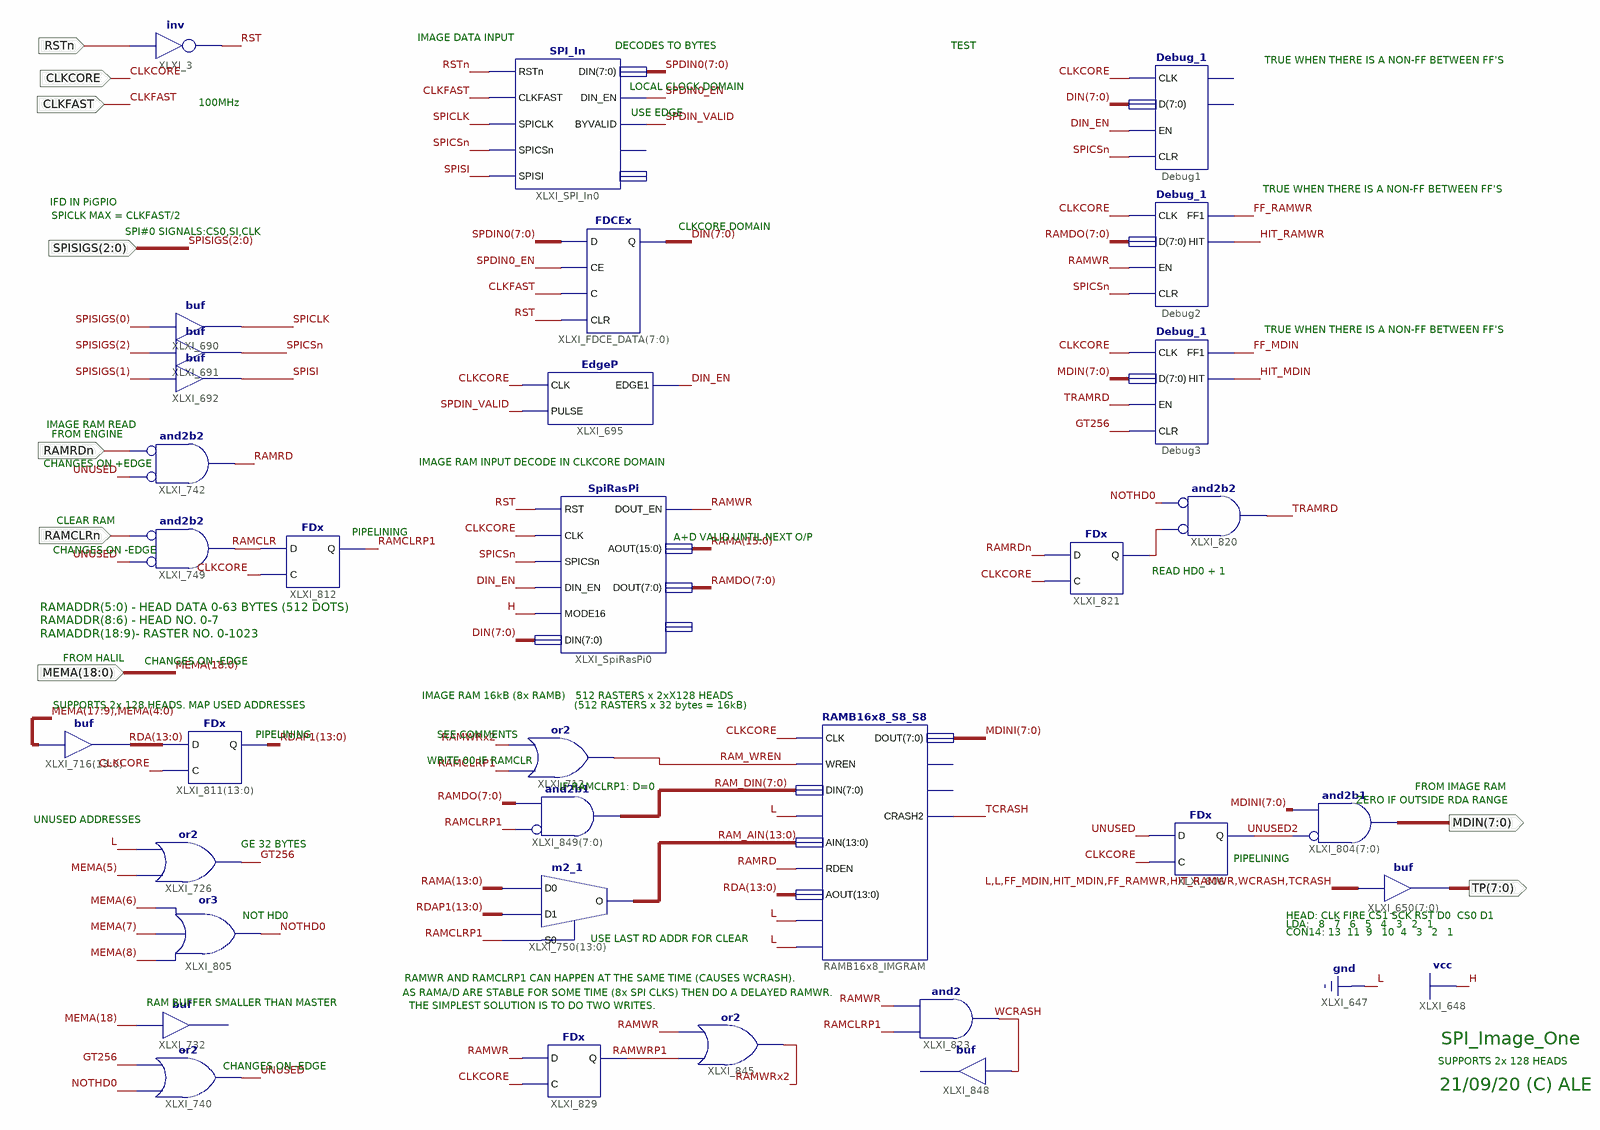
[diagram p0: schematic sheet 1]
// Xilinx ISE schematic SPI_Image_One.sch (spartan6) as structural Verilog: 33 symbols, 9 ports
module SPI_Image_One (
  input  CLKCORE,
  input  RSTn,
  input  [2:0] SPISIGS,
  input  CLKFAST,
  input  RAMCLRn,
  input  RAMRDn,
  input  [18:0] MEMA,
  output [7:0] TP,
  output [7:0] MDIN
);

  wire DIN_EN, FF_MDIN, FF_RAMWR, GT256, HIT_MDIN, HIT_RAMWR, NOTHD0, RAM_WREN, RAMCLR, RAMCLRP1, RAMRD,
       RAMWR, RAMWRP1, RAMWRx2, RST, SPDIN0_EN, SPDIN_VALID, SPICLK, SPICSn, SPISI, TCRASH, TRAMRD, UNUSED,
       UNUSED2, WCRASH, XLXN_62;
  wire [7:0] DIN, MDINI, RAM_DIN, RAMDO, SPDIN0;
  wire [13:0] RAM_AIN, RDA, RDAP1;
  wire [15:0] RAMA;

  buf XLXI_691 (SPICSn, SPISIGS[2]);
  buf XLXI_692 (SPISI, SPISIGS[1]);
  buf XLXI_690 (SPICLK, SPISIGS[0]);
  not XLXI_3 (RST, RSTn);
  and XLXI_742 (RAMRD, ~UNUSED, ~RAMRDn);  // and2b2
  or XLXI_726 (GT256, MEMA[5], 1'b0);
  and XLXI_749 (RAMCLR, ~UNUSED, ~RAMCLRn);  // and2b2
  or XLXI_805 (NOTHD0, MEMA[8], MEMA[7], MEMA[6]);
  // buf XLXI_732 has open pins: I=MEMA[18], O=open
  or XLXI_740 (UNUSED, NOTHD0, GT256);
  assign TP = {2'b00, FF_MDIN, HIT_MDIN, FF_RAMWR, HIT_RAMWR, WCRASH, TCRASH};  // buf XLXI_650[7..0], 8 bits wide
  assign MDIN = ~{8{UNUSED2}} & MDINI;  // and2b1 XLXI_804[7..0], 8 bits wide
  FDx XLXI_806 (.C(CLKCORE), .D(UNUSED), .Q(UNUSED2));
  FDx XLXI_812 (.C(CLKCORE), .D(RAMCLR), .Q(RAMCLRP1));
  Debug_1 Debug1 (.CLK(CLKCORE), .CLR(SPICSn), .D(DIN), .EN(DIN_EN));  // open: FF1, HIT
  Debug_1 Debug2 (.CLK(CLKCORE), .CLR(SPICSn), .D(RAMDO), .EN(RAMWR), .FF1(FF_RAMWR), .HIT(HIT_RAMWR));
  Debug_1 Debug3 (.CLK(CLKCORE), .CLR(GT256), .D(MDIN), .EN(TRAMRD), .FF1(FF_MDIN), .HIT(HIT_MDIN));
  FDx XLXI_821 (.C(CLKCORE), .D(RAMRDn), .Q(XLXN_62));
  and XLXI_820 (TRAMRD, ~XLXN_62, ~NOTHD0);  // and2b2
  SPI_In XLXI_SPI_In0 (
    .BYVALID(SPDIN_VALID), .CLKFAST(CLKFAST), .DIN(SPDIN0), .DIN_EN(SPDIN0_EN), .RSTn(RSTn), .SPICLK(SPICLK),
    .SPICSn(SPICSn), .SPISI(SPISI));  // open: CSEDGE, TP
  FDCEx XLXI_FDCE_DATA[7:0] (.C(CLKFAST), .CE(SPDIN0_EN), .CLR(RST), .D(SPDIN0), .Q(DIN));
  EdgeP XLXI_695 (.CLK(CLKCORE), .EDGE1(DIN_EN), .PULSE(SPDIN_VALID));
  SpiRasPi XLXI_SpiRasPi0 (
    .RST(RST), .CLK(CLKCORE), .SPICSn(SPICSn), .DIN_EN(DIN_EN), .MODE16(1'b1), .DIN(DIN), .DOUT_EN(RAMWR),
    .AOUT(RAMA), .DOUT(RAMDO));  // open: TP
  m2_1 XLXI_750[13:0] (.D0(RAMA[13:0]), .D1(RDAP1), .S0(RAMCLRP1), .O(RAM_AIN));
  or XLXI_712 (RAM_WREN, RAMCLRP1, RAMWRx2);
  assign RDA = {MEMA[17:9], MEMA[4:0]};  // buf XLXI_716[13..0], 14 bits wide
  FDx XLXI_811[13:0] (.C(CLKCORE), .D(RDA), .Q(RDAP1));
  FDx XLXI_829 (.C(CLKCORE), .D(RAMWR), .Q(RAMWRP1));
  or XLXI_845 (RAMWRx2, RAMWRP1, RAMWR);
  assign RAM_DIN = ~{8{RAMCLRP1}} & RAMDO;  // and2b1 XLXI_849[7..0], 8 bits wide
  and XLXI_823 (WCRASH, RAMCLRP1, RAMWR);
  // buf XLXI_848 has open pins: I=WCRASH, O=open
  RAMB16x8_S8_S8 RAMB16x8_IMGRAM (
    .AIN(RAM_AIN), .AOUT(RDA), .CLK(CLKCORE), .CRASH2(TCRASH), .DIN(RAM_DIN), .DIN8(1'b0), .DOUT(MDINI),
    .LIMIT2(1'b0), .LIMIT4(1'b0), .RDEN(RAMRD), .WREN(RAM_WREN));  // open: CRASH, DOUT8

  // Notes on the sheet:
  //   IMAGE DATA INPUT
  //   DECODES TO BYTES
  //   TEST
  //   TRUE WHEN THERE IS A NON-FF BETWEEN FF'S
  //   LOCAL CLOCK DOMAIN
  //   100MHz
  //   USE EDGE
  //   TRUE WHEN THERE IS A NON-FF BETWEEN FF'S
  //   IFD IN PiGPIO
  //   SPICLK MAX = CLKFAST/2
  //   CLKCORE DOMAIN
  //   SPI#0 SIGNALS:CS0,SI,CLK
  //   TRUE WHEN THERE IS A NON-FF BETWEEN FF'S
  //   IMAGE RAM READ
  //   FROM ENGINE
  //   IMAGE RAM INPUT DECODE IN CLKCORE DOMAIN
  //   CHANGES ON +EDGE
  //   CLEAR RAM
  //   PIPELINING
  //   A+D VALID UNTIL NEXT O/P
  //   CHANGES ON -EDGE
  //   READ HD0 + 1
  //   RAMADDR(5:0) - HEAD DATA 0-63 BYTES (512 DOTS)
  //   RAMADDR(8:6) - HEAD NO. 0-7
  //   RAMADDR(18:9)- RASTER NO. 0-1023
  //   FROM HALIL
  //   CHANGES ON -EDGE
  //   IMAGE RAM 16kB (8x RAMB)
  //   512 RASTERS x 2xX128 HEADS
  //   SUPPORTS 2x 128 HEADS. MAP USED ADDRESSES
  //   (512 RASTERS x 32 bytes = 16kB)
  //   PIPELINING
  //   SEE COMMENTS
  //   WRITE 00 IF RAMCLR
  //   IF RAMCLRP1: D=0
  //   FROM IMAGE RAM
  //   ZERO IF OUTSIDE RDA RANGE
  //   UNUSED ADDRESSES
  //   GE 32 BYTES
  //   PIPELINING
  //   NOT HD0
  //   HEAD: CLK FIRE CS1 SCK RST D0  CS0 D1
  //   LDA:   8   7   6   5   4   3   2   1
  //   CON14: 13  11  9   10  4   3   2   1
  //   USE LAST RD ADDR FOR CLEAR
  //   RAMWR AND RAMCLRP1 CAN HAPPEN AT THE SAME TIME (CAUSES WCRASH).
  //   AS RAMA/D ARE STABLE FOR SOME TIME (8x SPI CLKS) THEN DO A DELAYED RAMWR.
  //   RAM BUFFER SMALLER THAN MASTER
  //   THE SIMPLEST SOLUTION IS TO DO TWO WRITES.
  //   SPI_Image_One
  //   SUPPORTS 2x 128 HEADS
  //   CHANGES ON -EDGE
  //   21/09/20 (C) ALE
endmodule
